# EAGLE design CarteCerveau (EAGLE 7.6.0)

## Sheet 1 of 2
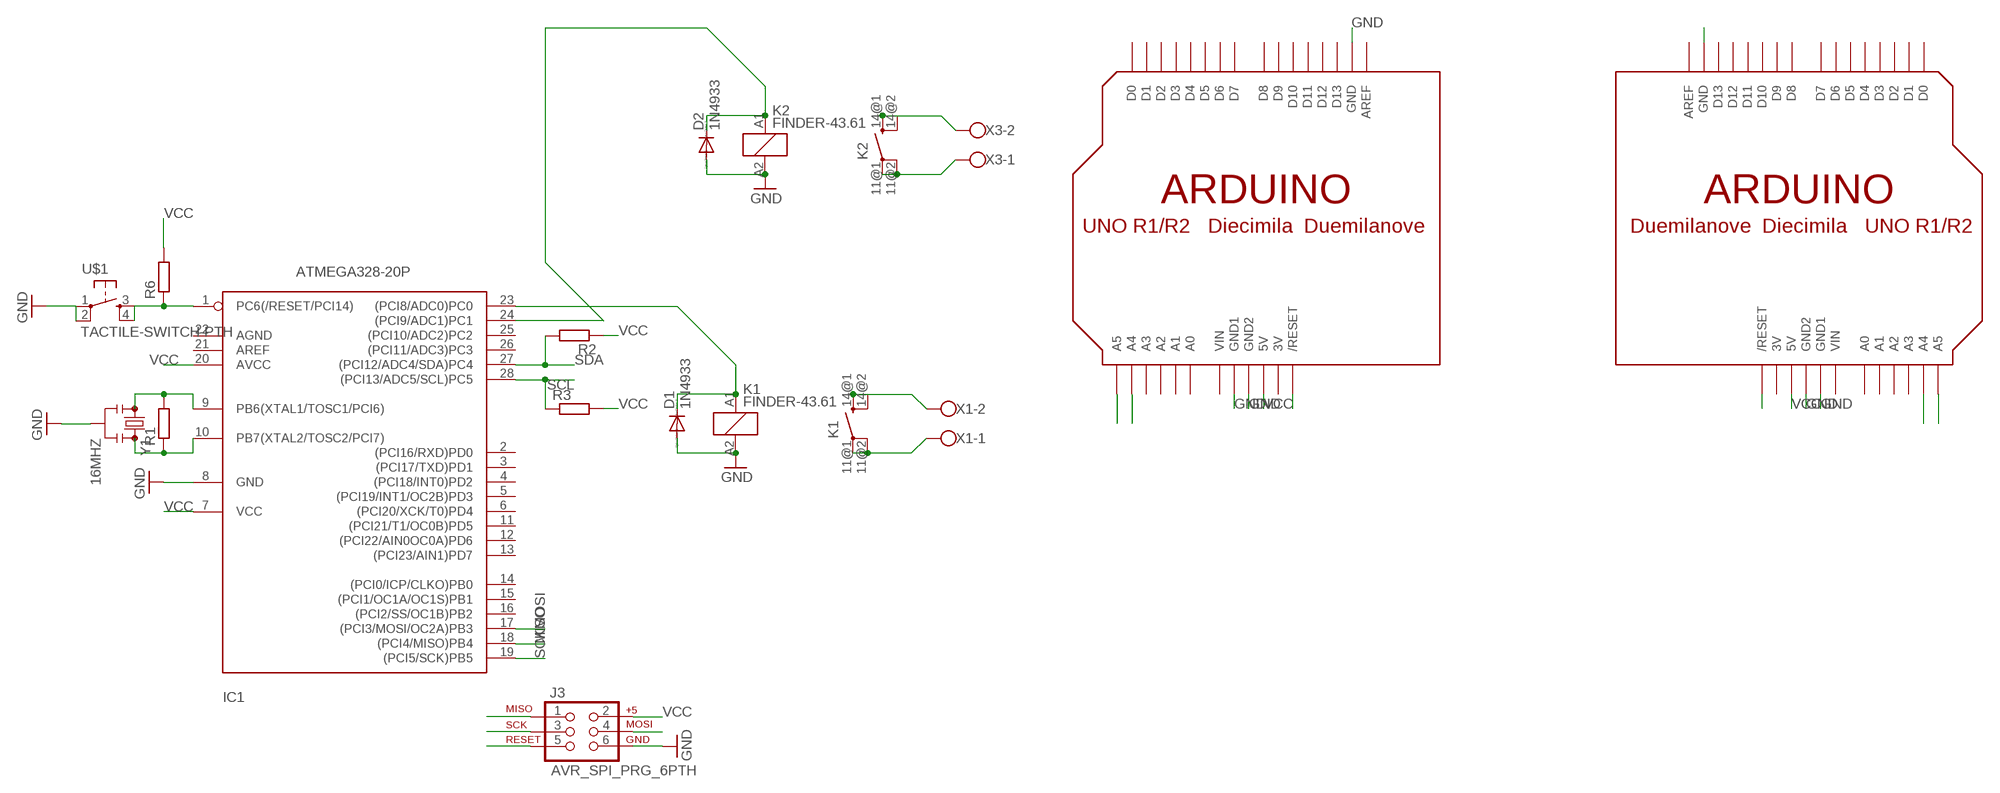
[diagram p0: schematic, sheet 1]

### Parts
D1  1N4933  [DO41-10]
D2  1N4933  [DO41-10]
IC1  ATMEGA328-20P  [DIL28-3]
J3  AVR_SPI_PRG_6PTH  [2X3]
K1  FINDER-43.61  [FINDER-43.61]
K2  FINDER-43.61  [FINDER-43.61]
R1  R-EU_R1206  [R1206]
R2  R-EU_R1206  [R1206]
R3  R-EU_R1206  [R1206]
R6  R-EU_R1206  [R1206]
U$1  TACTILE-SWITCH-PTH  [TAC-SWITCH-PTH]
U$2  ARDUINO-NOHOLE  [ARDUINO-NOHOLE]
U$3  ARDUINO-NOHOLE  [ARDUINO-NOHOLE]
X1  W237-102  [W237-102]
X3  W237-102  [W237-102]
Y1  16MHZ  RESONATOR16MHZ  [RESONATOR-SMD]

### Nets
GND: D1.A D2.A IC1.8(GND) J3.6 K1.A2 K2.A2 U$1.1 U$1.2 U$2.GND U$2.GND1 U$2.GND2 U$3.GND U$3.GND1 U$3.GND2 Y1.2 ; also sheet 2
MISO: IC1.18((PCI4/MISO)PB4) J3.1
MOSI: IC1.17((PCI3/MOSI/OC2A)PB3) J3.4
N$1: IC1.9(PB6(XTAL1/TOSC1/PCI6)) R1.2 Y1.1
N$2: IC1.10(PB7(XTAL2/TOSC2/PCI7)) R1.1 Y1.3
N$3: D1.C IC1.23((PCI8/ADC0)PC0) K1.A1
N$7: K1.14@1(-1:SA) K1.14@2(-1:SB) X1.2
N$9: K1.11@1(-1:PA) K1.11@2(-1:PB) X1.1
N$10: D2.C IC1.24((PCI9/ADC1)PC1) K2.A1
N$11: K2.14@1(-1:SA) K2.14@2(-1:SB) X3.2
N$12: K2.11@1(-1:PA) K2.11@2(-1:PB) X3.1
RST: IC1.1(PC6(/RESET/PCI14)) J3.5 R6.1 U$1.3 U$1.4 U$2.RESET(/RESET) U$3.RESET(/RESET)
SCK: IC1.19((PCI5/SCK)PB5) J3.3
SCL: IC1.28((PCI13/ADC5/SCL)PC5) R3.1 U$2.A5 U$3.A5
SDA: IC1.27((PCI12/ADC4/SDA)PC4) R2.2 U$2.A4 U$3.A4
VCC: IC1.7(VCC) IC1.20(AVCC) J3.2 R2.1 R3.2 R6.2 U$2.5V U$3.5V ; also sheet 2
Unconnected: IC1.2((PCI16/RXD)PD0) IC1.3((PCI17/TXD)PD1) IC1.4((PCI18/INT0)PD2) IC1.5((PCI19/INT1/OC2B)PD3) IC1.6((PCI20/XCK/T0)PD4) IC1.11((PCI21/T1/OC0B)PD5) IC1.12((PCI22/AIN0OC0A)PD6) IC1.13((PCI23/AIN1)PD7) IC1.14((PCI0/ICP/CLKO)PB0) IC1.15((PCI1/OC1A/OC1S)PB1) IC1.16((PCI2/SS/OC1B)PB2) IC1.21(AREF) IC1.22(AGND) IC1.25((PCI10/ADC2)PC2) IC1.26((PCI11/ADC3)PC3) U$2.A0 U$2.A1 U$2.A2 U$2.A3 U$2.AREF U$2.D0 U$2.D1 U$2.D2 U$2.D3 U$2.D4 U$2.D5 U$2.D6 U$2.D7 U$2.D8 U$2.D9 U$2.D10 U$2.D11 U$2.D12 U$2.D13 U$3.A0 U$3.A1 U$3.A2 U$3.A3 U$3.AREF U$3.D0 U$3.D1 U$3.D2 U$3.D3 U$3.D4 U$3.D5 U$3.D6 U$3.D7 U$3.D8 U$3.D9 U$3.D10 U$3.D11 U$3.D12 U$3.D13

## Sheet 2 of 2
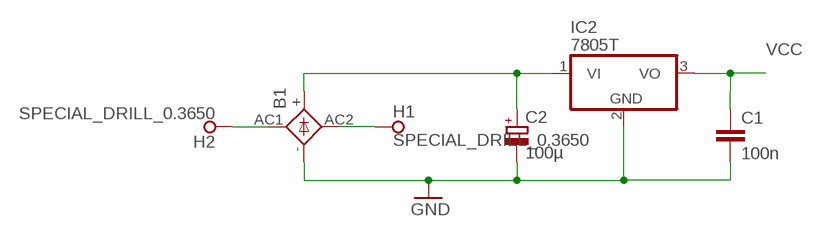
[diagram p1: schematic, sheet 2]

### Parts
B1  2KBB-R  [2KBB-R]
C1  100n  C-EUC1206  [C1206]
C2  100µ  CPOL-EUB45181A  [B45181A]
H1  SPECIAL_DRILL_0.3650  [PAD_0.3650]
H2  SPECIAL_DRILL_0.3650  [PAD_0.3650]
IC2  7805T  [TO220H]

### Nets
GND: B1.- C1.2 C2.- IC2.2(GND) ; also sheet 1
N$5: B1.AC1 H2.1
N$6: B1.AC2 H1.1
N$8: B1.+ C2.+ IC2.1(VI)
VCC: C1.1 IC2.3(VO) ; also sheet 1

## Power pins joined to a net without a drawn wire
3V: U$2.3V U$3.3V
VIN: U$2.VIN U$3.VIN

## Library data of the parts
B1 = rectifier:2KBB-R: RECTIFIER grid 3 x 5 mm
C1 = resistor:C-EU: CAPACITOR, European symbol
C2 = resistor:CPOL-EU: POLARIZED CAPACITOR, European symbol
D1 D2 = diode:1N4933: DIODE fast recovery rectifier, 1A
H1 H2 = special-drill:SPECIAL_DRILL_: Special drills
IC1 = atmega328:ATMEGA328*P: MICROCONTROLLER 32 kBytes FLASH 2 kBytes SRAM 1 kBytes EEPROM USART 8-channel 10 bit ADC
IC2 = linear:78*: Positive VOLTAGE REGULATOR Source: http://cache.national.com/ds/LM/LM78L05.pdf http://www.fairchildsemi.com/ds/LM/LM7805.pdf
J3 = SparkFun-Connectors:AVR_SPI_PRG_6: AVR ISP 6 Pin This is the reduced ISP connector for AVR programming. Common on Arduino. This footprint will take up less PCB space and can be used with a 10-pin to 6-pin adapter such as SKU: BOB-08508 **Special note about "TEST_POINT" package. The stop mask is on the top side, so if you want your programming test points to be on the bottom of your board, make sure to place this package on the bottom side of the board. This also ensure that the orientation to program from the bottom side will be correct.
K1 K2 = relay:FINDER-43.61: Low profile PCB relays 10 - 16 A FINDER 43 Series Kontakt max. AC- 250V, Strom - Kontakt AC- max. 10A 5 mm contact pin pitch, 1 Pole NO, 16 A, PCB mount Distributor: FARNELL Source: http://www.farnell.com/datasheets/87682.pdf; OC_FARNELL: unknown; OC_NEWARK: unknown
R1-R3 R6 = rcl:R-EU_: RESISTOR, European symbol
U$1 = GeekAmmo:TACTILE-SWITCH: Tactile Switch 4 Pins, SPST NO
U$2 U$3 = adafruit:ARDUINO: Arduino Diecimila/Duemilanove Make a shield with ease, this package has all the named pins as well as the two mounting drill holes and an outline of the USB and DC power connector. The outline is on the DIMENSION layer, so if your board house uses it they will cut the outline to match. http://www.ladyada.net/library/pcb/eaglelibrary.html
X1 X3 = con-wago-500:W237-102: WAGO SCREW CLAMP; MPN: 237-102; OC_FARNELL: unknown; OC_NEWARK: 70K9898
Y1 = SparkFun-FreqCtrl:RESONATOR: Resonator Small SMD resonator. Used, eg, on the Arduino Pro/ Pro Mini boards. 8MHz- XTAL-08895 16MHz- XTAL-08900; PROD_ID: XTAL-08900

## Net classes
0 default: width 0.254 mm, clearance 0.254 mm

## Board
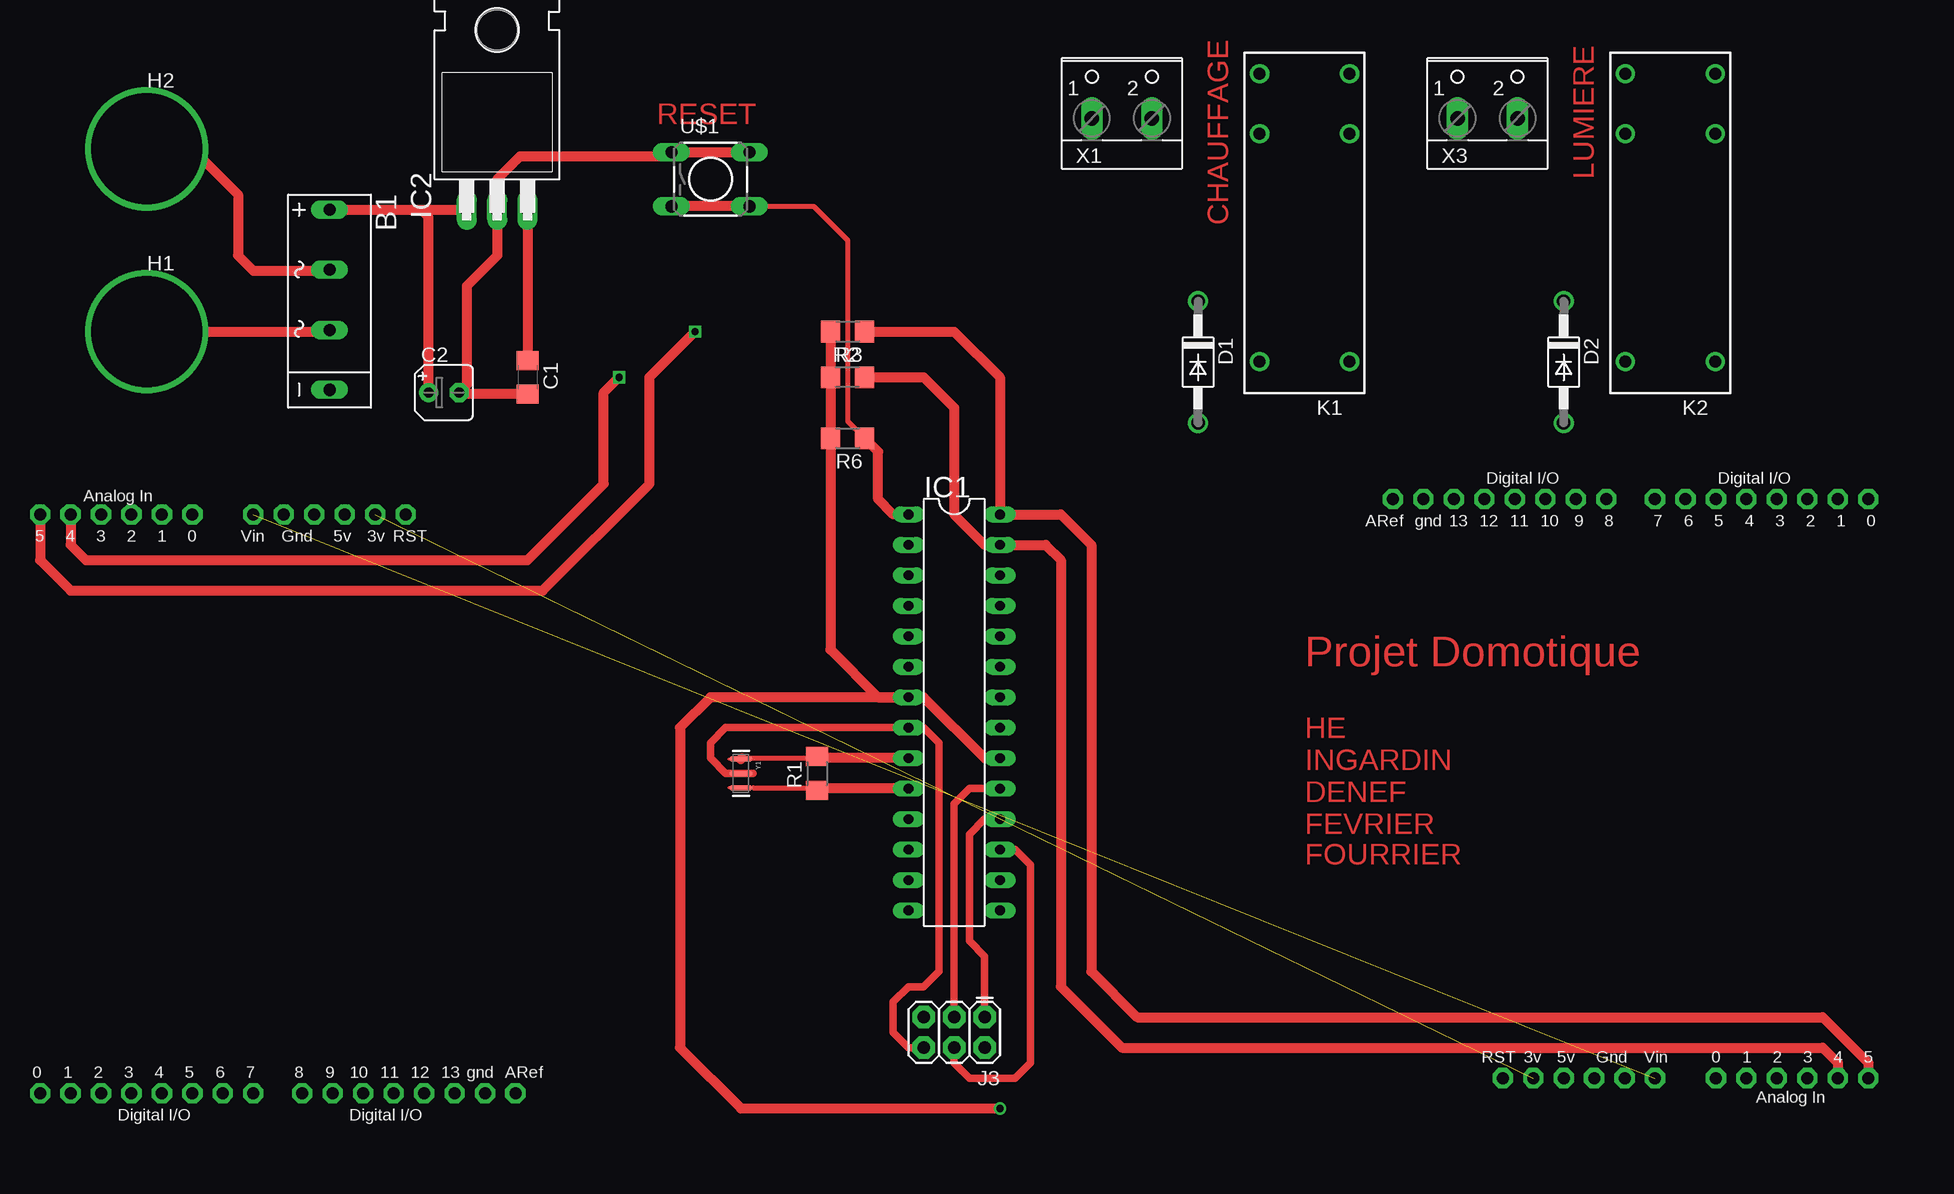
[diagram p2: board, top side]
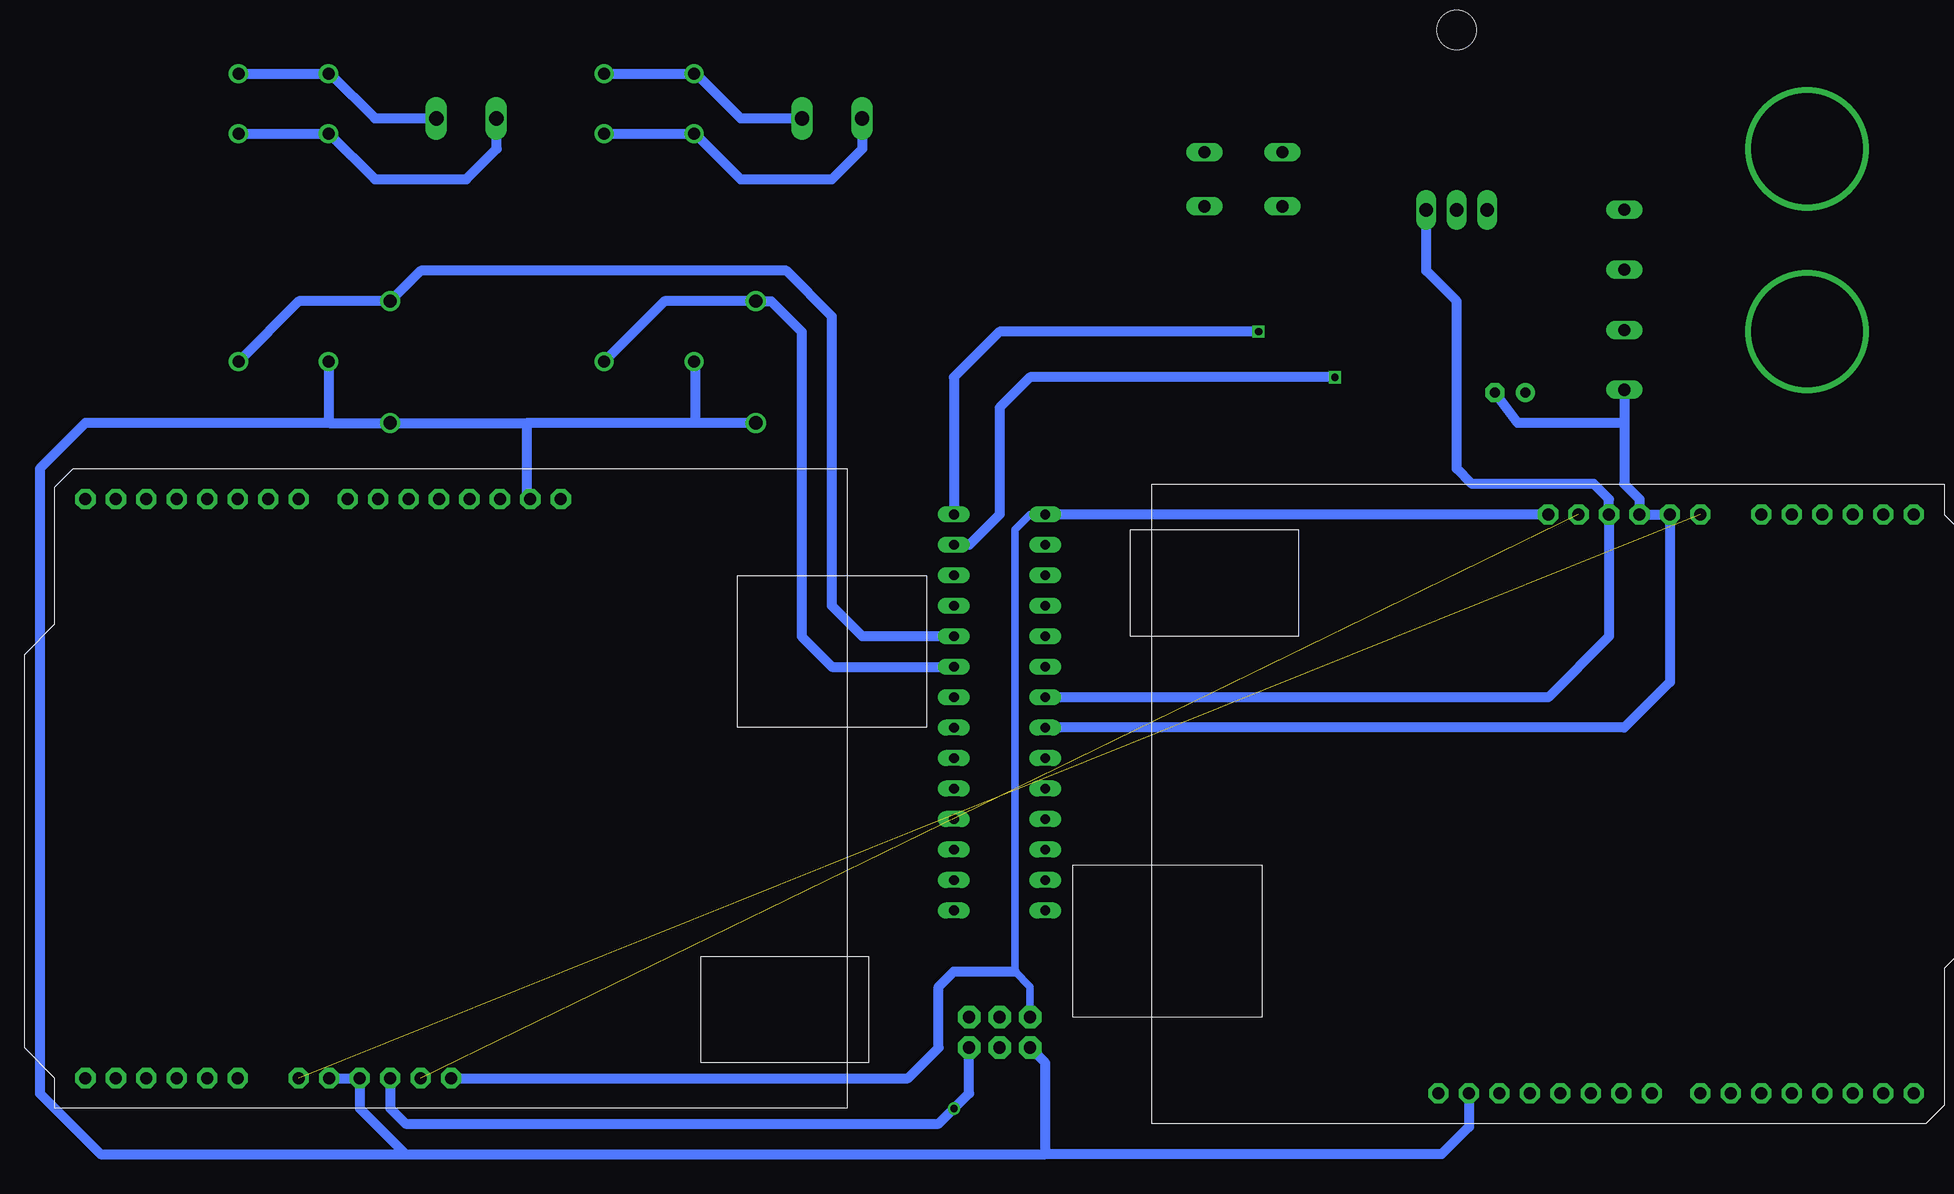
[diagram p3: board, bottom side, seen from below]

No outline drawn. Coordinates in mm, seen from the top.
Copper layers (1*16): Top 0.035mm / dielectric 1.5mm / Bottom 0.035mm
Design rules "default": minimum track width 10mil, minimum drill 24mil, track to track 8mil, track to pad 8mil, pad to pad 8mil, via to via 8mil, smd to smd 8mil, copper to edge 40mil, drill to drill 8mil, minimum pad ring 10mil, minimum via ring 8mil, stop-mask expansion 4mil, vias tented up to drill 0mil, thermal gap 10mil

### Footprints (pad centres in the part's own frame; a part is rotated, then mirrored left to right if it is on the bottom)
2KBB-R = drill 1.016 long: + -7.62,0; - 7.391,0; AC1 -2.616,0; AC2 2.413,0
C1206 = smd 1.6 x 1.8: 1 -1.4,0; 2 1.4,0
B45181A = drill 0.813 pad 1.6: + -1.27,0 | drill 0.813 pad 1.6 octagon: - 1.27,0
DO41-10 = drill 1.118: A 5.08,0; C -5.08,0
PAD_0.3650 = drill 9.271 pad 9.271: 1 0,0
DIL28-3 = drill 0.813 long: 1 -16.51,-3.81; 2 -13.97,-3.81; 3 -11.43,-3.81; 4 -8.89,-3.81; 5 -6.35,-3.81; 6 -3.81,-3.81; 7 -1.27,-3.81; 8 1.27,-3.81; 9 3.81,-3.81; 10 6.35,-3.81; 11 8.89,-3.81; 12 11.43,-3.81; 13 13.97,-3.81; 14 16.51,-3.81; 15 16.51,3.81; 16 13.97,3.81; 17 11.43,3.81; 18 8.89,3.81; 19 6.35,3.81; 20 3.81,3.81; 21 1.27,3.81; 22 -1.27,3.81; 23 -3.81,3.81; 24 -6.35,3.81; 25 -8.89,3.81; 26 -11.43,3.81; 27 -13.97,3.81; 28 -16.51,3.81
TO220H = drill 1.118 long: 1 -2.54,-10.16; 2 0,-10.16; 3 2.54,-10.16 | hole 3.302: 0,4.826
2X3 = drill 1.016 pad 1.88 octagon: 1 0,0; 2 0,2.54; 3 2.54,0; 4 2.54,2.54; 5 5.08,0; 6 5.08,2.54
FINDER-43.61 = drill 1 pad 1.6: 11@1 0,3.75; 11@2 0,-3.75; 14@1 5,3.75; 14@2 5,-3.75; A1 -19,-3.75; A2 -19,3.75
R1206 = smd 1.6 x 1.803: 1 -1.422,0; 2 1.422,0
TAC-SWITCH-PTH = drill 1.016 pad 1.524 long: 1 -3.251,2.261; 2 3.251,2.261; 3 -3.251,-2.261; 4 3.251,-2.261
ARDUINO-NOHOLE = drill 1 pad 1.676 octagon: 3V 35.56,2.54; 5V 38.1,2.54; A0 50.8,2.54; A1 53.34,2.54; A2 55.88,2.54; A3 58.42,2.54; A4 60.96,2.54; A5 63.5,2.54; AREF 23.876,50.8; D0 63.5,50.8; D1 60.96,50.8; D2 58.42,50.8; D3 55.88,50.8; D4 53.34,50.8; D5 50.8,50.8; D6 48.26,50.8; D7 45.72,50.8; D8 41.656,50.8; D9 39.116,50.8; D10 36.576,50.8; D11 34.036,50.8; D12 31.496,50.8; D13 28.956,50.8; GND 26.416,50.8; GND1 43.18,2.54; GND2 40.64,2.54; RESET 33.02,2.54; VIN 45.72,2.54
W237-102 = drill 1.194 long: 1 -2.5,-1.27; 2 2.5,-1.27
RESONATOR-SMD = smd 0.45 x 1.905: 1 -1.2,0; 2 0,0; 3 1.2,0

### Placement (x,y rotation side)
B1  -33.02,74.93 270 top
C1  -16.51,68.58 270 top
C2  -23.5,67.31 0 top
D1  39.37,69.85 270 top
D2  69.85,69.85 270 top
H1  -48.26,72.39 0 top
H2  -48.26,87.63 0 top
IC1  19.05,40.64 270 top
IC2  -19.05,92.71 0 top
J3  21.59,15.24 180 top
K1  48.26,88.9 90 top
K2  78.74,88.9 90 top
R1  7.62,35.56 90 top
R2  10.16,68.58 0 top
R3  10.16,72.39 180 top
R6  10.16,63.5 180 top
U$1  -1.27,85.09 0 top
U$2  31.75,7.62 0 top
U$3  6.35,59.69 180 top
X1  33.02,91.44 0 top
X3  63.5,91.44 0 top
Y1  1.27,35.56 270 top

### Tracks (layer width: path | path; a pad name or v marks a point on that pad's centre or on a via)
3V  (1 unrouted)
GND
  Top 0.61: J3.6 15.24,12.7 13.97,13.97 13.97,16.51 15.24,17.78 16.51,17.78 17.78,19.05 17.78,38.1 16.51,39.37 IC1.8 0,39.37 -1.27,38.1 -1.27,36.83 0,35.56 2.29,35.56
  Top 0.813: C1.2 -22.09,67.18 C2.- -21.59,67.94 -21.59,76.2 -19.05,78.74 IC2.2 -19.05,85.09 -17.14,87 -4.88,87 U$1.1 U$1.2
  Bottom 0.813: U$2.GND1 U$2.GND2 72.39,7.62 68.58,3.81 | 15.24,3.81 15.24,11.43 J3.6 | IC1.8 -33.02,39.37 -36.83,43.18 U$3.GND1 U$3.GND2 -34.29,58.42 -33.02,59.69 -33.02,64.77 | U$3.GND -20.07,6.1 -17.78,3.81 15.24,3.81 | 68.58,3.81 15.24,3.81 | D1.A 44.45,64.77 | 44.45,64.77 58.42,64.77 | 74.93,64.77 95.25,64.77 99.06,60.96 99.06,8.89 93.98,3.81 68.58,3.81 | K1.A2 44.45,69.84 44.45,64.77 | U$2.GND 58.42,58.67 58.42,64.77 | K2.A2 74.99,64.83 74.93,64.77 | 74.93,64.77 D2.A 58.42,64.77 | B1.- -33.02,64.77 | -33.02,64.77 -24.13,64.77 C2.-
MISO
  Top 0.61: J3.1 21.59,20.32 20.32,21.59 20.32,30.48 21.59,31.75 IC1.18
MOSI
  Top 0.61: IC1.17 24.13,29.21 25.4,27.94 25.4,11.43 24.13,10.16 20.32,10.16 19.05,11.43 J3.4
N$1
  Top 0.406: 1.34,36.83 7.47,36.83 R1.2
  Top 0.813: 1.34,36.83 Y1.1 | IC1.9 7.77,36.83 R1.2
N$2
  Top 0.406: 2.29,34.36 7.4,34.36 R1.1
  Top 0.813: IC1.10 7.77,34.29 R1.1
N$3
  Bottom 0.813: IC1.23 33.02,44.45 35.56,46.99 35.56,72.39 38.1,74.93 D1.C 46.99,74.93 K1.A1
N$5
  Top 0.813: H2.1 -44.45,87.63 -40.64,83.82 -40.64,78.74 -39.37,77.47 -33.1,77.47 B1.AC1
N$6
  Top 0.813: H1.1 -33.02,72.39 B1.AC2
N$7
  Bottom 0.813: K1.14@2 K1.14@1 44.37,93.9 40.64,90.17 X1.2
N$8
  Top 0.813: B1.+ -25.4,82.55 | -25.4,82.55 IC2.1 | C2.+ -24.77,81.92 -25.4,82.55
N$9
  Bottom 0.813: K1.11@2 K1.11@1 44.45,88.9 40.64,85.09 33.02,85.09 30.48,87.63 30.48,90.13 X1.1
N$10
  Bottom 0.813: IC1.24 30.48,46.99 33.02,49.53 33.02,73.66 36.83,77.47 67.31,77.47 D2.C 77.46,74.93 K2.A1
N$11
  Bottom 0.813: K2.14@2 K2.14@1 74.85,93.9 71.12,90.17 X3.2
N$12
  Bottom 0.813: K2.11@2 K2.11@1 74.93,88.9 71.12,85.09 63.5,85.09 60.96,87.63 60.96,90.13 X3.1
RST
  Top 0.406: U$1.4 7.34,82.83 10.16,80.01 10.16,64.92 R6.1
  Top 0.813: IC1.1 13.97,57.15 12.7,58.42 12.7,62.38 R6.1 | U$1.4 U$1.3
  Bottom 0.61: IC1.1 16.51,57.15 17.78,55.88 17.78,19.05 16.51,17.78 J3.5
  Bottom 0.813: U$2.RESET 26.67,10.16 24.13,12.7 24.13,17.78 22.86,19.05 17.78,19.05 | U$3.RESET IC1.1
SCK
  Top 0.61: J3.3 19.05,33.02 20.32,34.29 IC1.19
SCL  (via drill 0.6)
  Top 0.813: R3.1 19.05,72.39 22.86,68.58 IC1.28 27.94,57.15 30.48,54.61 30.48,19.05 34.29,15.24 91.44,15.24 95.25,11.43 U$2.A5 | U$3.A5 -57.15,53.34 -54.61,50.8 -15.24,50.8 -6.35,59.69 -6.35,68.58 v-2.54,72.39
  Bottom 0.813: v-2.54,72.39 19.05,72.39 22.86,68.58 IC1.28
SDA  (via drill 0.6)
  Top 0.813: R2.2 16.51,68.58 19.05,66.04 19.05,57.15 21.59,54.61 IC1.27 26.67,54.61 27.94,53.34 27.94,17.78 33.02,12.7 91.44,12.7 92.71,11.43 U$2.A4 | U$3.A4 -54.61,54.61 -53.34,53.34 -16.51,53.34 -10.16,59.69 -10.16,67.31 v-8.89,68.58
  Bottom 0.813: v-8.89,68.58 16.51,68.58 19.05,66.04 19.05,57.15 21.59,54.61 IC1.27
VCC  (via drill 0.6)
  Top 0.813: IC2.3 C1.1 | IC1.7 12.7,41.91 8.74,45.87 R6.2 R2.1 R3.2 | IC1.7 -1.27,41.91 -3.81,39.37 -3.81,12.7 1.27,7.62 v22.86,7.62 | IC1.7 16.51,41.91 21.59,36.83 IC1.20
  Bottom 0.813: J3.2 21.59,8.89 v22.86,7.62 24.13,6.35 68.58,6.35 69.85,7.62 U$2.5V | IC1.7 -26.67,41.91 -31.75,46.99 U$3.5V -31.75,58.42 -30.48,59.69 -20.32,59.69 -19.05,60.96 -19.05,74.93 -16.51,77.47 IC2.3
VIN  (1 unrouted)

### Text on the board
Top: RESET | LUMIERE | CHAUFFAGE | Projet Domotique | HE / INGARDIN / DENEF / FEVRIER | FOURRIER